# Altium schematic sheet Filters.SchDoc: Sample Sheet Title
size B; Date: MM/DD/YYYY; Author: Sample Author; Organization: ORGANIZATION; Address1: ADDRESS 1; Address2: ADDRESS 2; Address3: ADDRESS 3; Address4: ADDRESS 4; Revision: -; SheetNumber: 1; SheetTotal: 1; ENG_APP_DATE: --/--/--; DSN_APP_DATE: --/--/--; CHK_APP_DATE: --/--/--
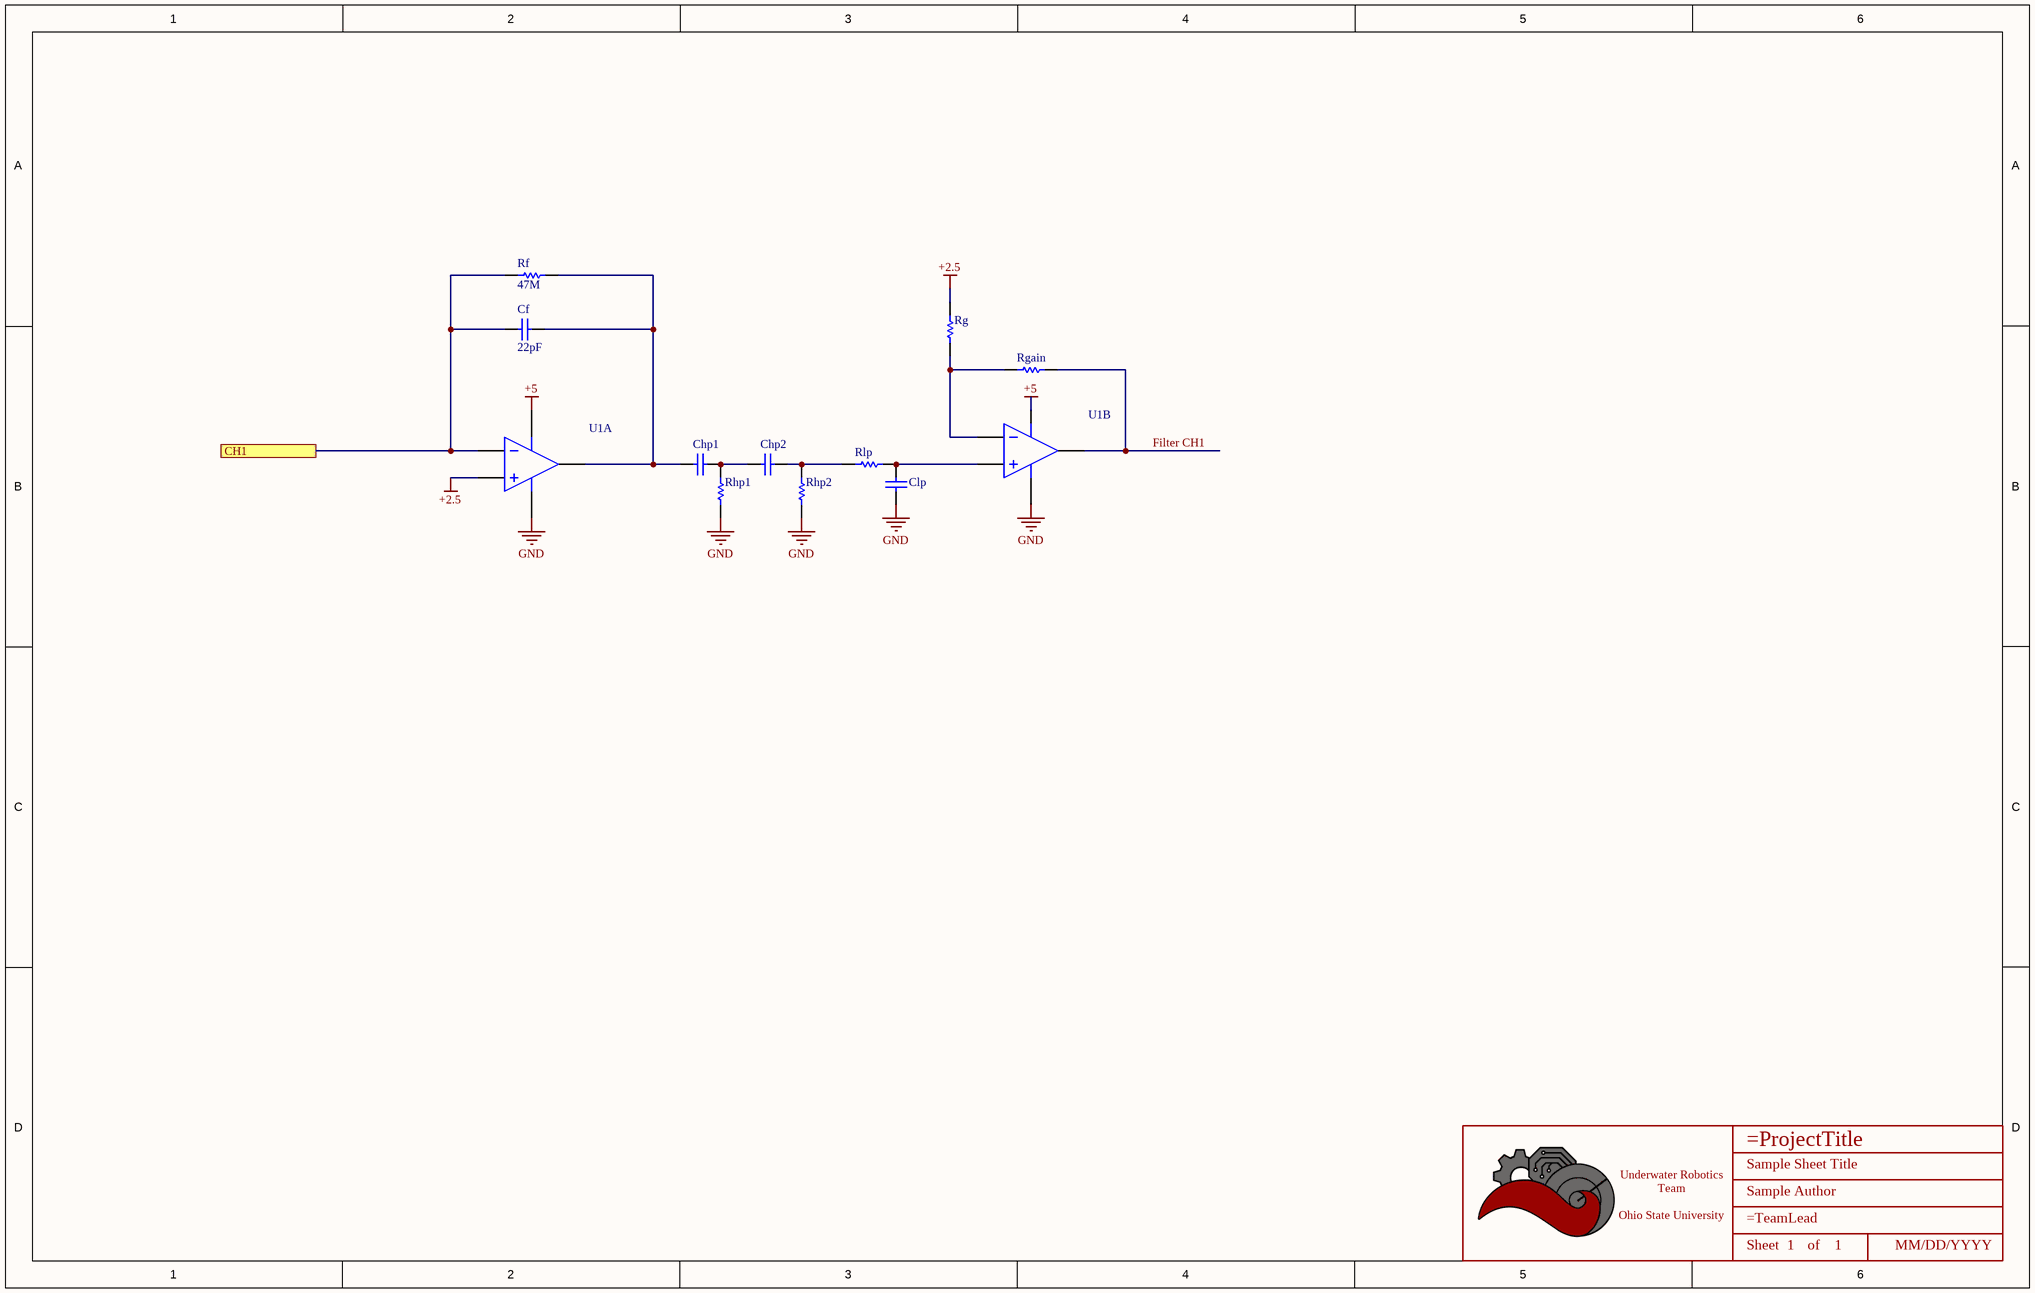
[diagram p0: Filters.SchDoc]

## Parts
*  Title_Block  [LOGO]  (value not drawn)  (graphical)
Cf  value 22pF  (hidden comment: Capacitor)
Chp1  Capacitor  (value not drawn)
Chp2  Capacitor  (value not drawn)
Clp  Capacitor  (value not drawn)
Rf  value 47M  (hidden comment: Resistor)
Rg  Resistor  (value not drawn)
Rgain  Resistor  (value not drawn)
Rhp1  Resistor  (value not drawn)
Rhp2  Resistor  (value not drawn)
Rlp  Resistor  (value not drawn)
U1A  Ideal Operational Amplifier  (value not drawn)
U1B  Ideal Operational Amplifier  (value not drawn)

## Ports
CH1

## Nets
+2.5: Rg.2 U1A.2(IN+)
+5: U1A.4(V+) U1B.4(V+)
GND: Clp.1 Rhp1.2 Rhp2.2 U1A.5(V-) U1B.5(V-)
CH1: Cf.1 Rf.1 U1A.1(IN-) ; port CH1
Filter CH1: Rgain.2 U1B.3(OUT)
NetCf_2: Cf.2 Chp1.1 Rf.2 U1A.3(OUT)
NetChp1_2: Chp1.2 Chp2.1 Rhp1.1
NetChp2_2: Chp2.2 Rhp2.1 Rlp.1
NetClp_2: Clp.2 Rlp.2 U1B.2(IN+)
NetRg_1: Rg.1 Rgain.1 U1B.1(IN-)

## Notes on the sheet
- DWG. NO.
- REV.
- SHT.
- THIS DOCUMENT AND THE DATA DISCLOSED HEREIN OR HEREWITH IS THE PROPERTY OF ALTIUM LIMITED AND MAY BE FREELY DISTRIBUTED IN WHOLE. NO RIGHTS ARE RESERVED OR EXPRESS OR IMPLIED WARANTEE GIVEN.
- REVISION
- DESCRIPTION
- DATE
- APPROVED
- ENG:
- APPROVALS
- PROJECT
- DSN:
- CHK:
- REFERENCE DOCUMENTS
- PROJECT REVISION:
- TITLE
- DOCUMENT REVISION:
- DESIGN ITEM:
- BOM:
- FAB DWG:
- PCB DWG:
- ASSY DWG:
- SCALE:
- SIZE
- B
- CAGE CODE
- FILE NAME
- DWG NO.
- SHEET
- OF
- REV
- (in symbol Title_Block) Underwater Robotics Team / Ohio State University; Sheet; of

## Library data of the parts
* = Title_Block: UWRT Schematic Title Block Template / Created June 2021, Dylan Trainor
Cf Chp1 Chp2 Clp = Capacitor: SimulationGenericComponent: True
Rf Rg Rgain Rhp1 Rhp2 Rlp = Resistor: TC1: 0; SimulationGenericComponent: True; TC2: 0
U1A U1B = OpAmp with power terminals: SimulationGenericComponent: True